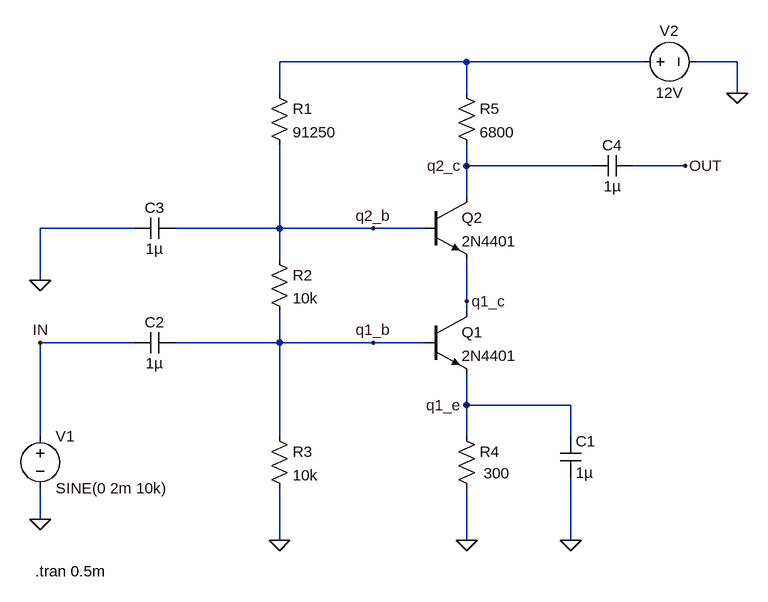
[diagram p0: schematic prelab1.asc]
prelab1.asc, the LTspice schematic file:
Version 4
SHEET 1 1204 680
WIRE 720 -512 432 -512
WIRE 992 -512 720 -512
WIRE 1136 -512 1072 -512
WIRE 432 -464 432 -512
WIRE 720 -464 720 -512
WIRE 1136 -464 1136 -512
WIRE 720 -352 720 -384
WIRE 912 -352 720 -352
WIRE 1056 -352 976 -352
WIRE 720 -304 720 -352
WIRE 208 -256 64 -256
WIRE 432 -256 432 -384
WIRE 432 -256 272 -256
WIRE 576 -256 432 -256
WIRE 656 -256 576 -256
WIRE 432 -208 432 -256
WIRE 64 -176 64 -256
WIRE 720 -144 720 -208
WIRE 720 -128 720 -144
WIRE 208 -80 64 -80
WIRE 432 -80 432 -128
WIRE 432 -80 272 -80
WIRE 576 -80 432 -80
WIRE 656 -80 576 -80
WIRE 720 16 720 -32
WIRE 880 16 720 16
WIRE 64 64 64 -80
WIRE 432 64 432 -80
WIRE 720 64 720 16
WIRE 880 64 880 16
WIRE 64 192 64 144
WIRE 432 224 432 144
WIRE 720 224 720 144
WIRE 880 224 880 128
FLAG 1136 -464 0
FLAG 64 192 0
FLAG 432 224 0
FLAG 720 224 0
FLAG 880 224 0
FLAG 64 -176 0
FLAG 576 -80 q1_b
FLAG 720 16 q1_e
FLAG 720 -144 q1_c
FLAG 576 -256 q2_b
FLAG 720 -352 q2_c
FLAG 1056 -352 OUT
FLAG 64 -80 IN
SYMBOL voltage 976 -512 R270
WINDOW 0 32 56 VTop 2
WINDOW 3 -32 56 VBottom 2
WINDOW 123 0 0 Left 0
WINDOW 39 0 0 Left 0
SYMATTR InstName V2
SYMATTR Value 12V
SYMBOL res 416 -480 R0
SYMATTR InstName R1
SYMATTR Value 91250
SYMBOL res 416 -224 R0
SYMATTR InstName R2
SYMATTR Value 10k
SYMBOL res 416 48 R0
SYMATTR InstName R3
SYMATTR Value 10k
SYMBOL res 704 48 R0
WINDOW 3 42 73 Left 2
SYMATTR InstName R4
SYMATTR Value 300
SYMBOL npn 656 -128 R0
SYMATTR InstName Q1
SYMATTR Value 2N4401
SYMBOL npn 656 -304 R0
SYMATTR InstName Q2
SYMATTR Value 2N4401
SYMBOL res 704 -480 R0
SYMATTR InstName R5
SYMATTR Value 6800
SYMBOL cap 864 64 R0
SYMATTR InstName C1
SYMATTR Value 1µ
SYMBOL cap 272 -96 R90
WINDOW 0 0 32 VBottom 2
WINDOW 3 32 32 VTop 2
SYMATTR InstName C2
SYMATTR Value 1µ
SYMBOL cap 272 -272 R90
WINDOW 0 0 32 VBottom 2
WINDOW 3 32 32 VTop 2
SYMATTR InstName C3
SYMATTR Value 1µ
SYMBOL cap 976 -368 R90
WINDOW 0 0 32 VBottom 2
WINDOW 3 32 32 VTop 2
SYMATTR InstName C4
SYMATTR Value 1µ
SYMBOL voltage 64 48 R0
WINDOW 123 0 0 Left 0
WINDOW 39 0 0 Left 0
SYMATTR InstName V1
SYMATTR Value SINE(0 2m 10k)
TEXT 56 272 Left 2 !.tran 0.5m

The netlist it stands for:
* prelab1.asc
V2 N001 0 12V
R1 N001 q2_b 91250
R2 q2_b q1_b 10k
R3 q1_b 0 10k
R4 q1_e 0 300
Q1 q1_c q1_b q1_e 0 2N4401
Q2 q2_c q2_b q1_c 0 2N4401
R5 N001 q2_c 6800
C1 q1_e 0 1µ
C2 q1_b IN 1µ
C3 q2_b 0 1µ
C4 OUT q2_c 1µ
V1 IN 0 SINE(0 2m 10k)
.model NPN NPN
.model PNP PNP
.lib standard.bjt
.tran 0.5m
.backanno
.end